# Altium schematic sheet main.SchDoc
size A4
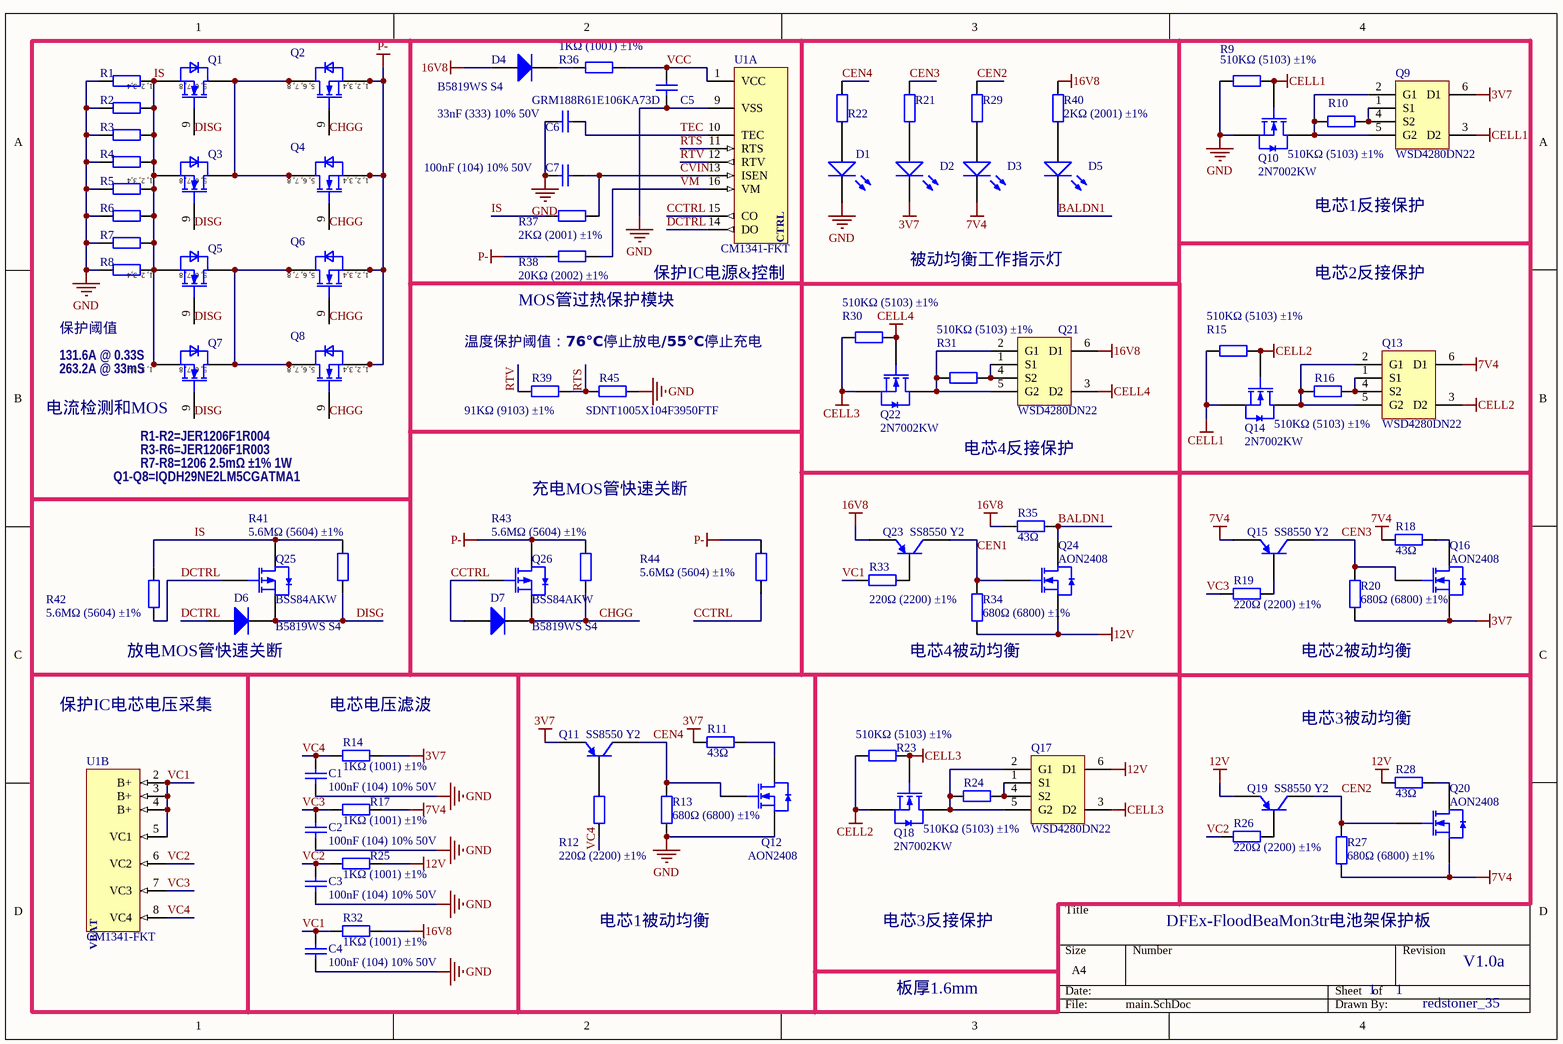
[diagram p0: main.SchDoc]

## Parts
C1  100nF (104) 10% 50V  [0402_C]
C2  100nF (104) 10% 50V  [0402_C]
C3  100nF (104) 10% 50V  [0402_C]
C4  100nF (104) 10% 50V  [0402_C]
C5  GRM188R61E106KA73D  [0603_C]
C6  33nF (333) 10% 50V  [0402_C]
C7  100nF (104) 10% 50V  [0402_C]
D1  白灯 0603  [0603_LED_S1]  (value not drawn)
D2  白灯 0603  [0603_LED_S1]  (value not drawn)
D3  白灯 0603  [0603_LED_S1]  (value not drawn)
D4  B5819WS S4  [SOD-323]
D5  白灯 0603  [0603_LED_S1]  (value not drawn)
D6  B5819WS S4  [SOD-323]
D7  B5819WS S4  [SOD-323]
Q1  IQDH29NE2LM5CG  [IFX-PG-WHTFN-9-2-V]  (value not drawn)
Q2  IQDH29NE2LM5CG  [IFX-PG-WHTFN-9-2-V]  (value not drawn)
Q3  IQDH29NE2LM5CG  [IFX-PG-WHTFN-9-2-V]  (value not drawn)
Q4  IQDH29NE2LM5CG  [IFX-PG-WHTFN-9-2-V]  (value not drawn)
Q5  IQDH29NE2LM5CG  [IFX-PG-WHTFN-9-2-V]  (value not drawn)
Q6  IQDH29NE2LM5CG  [IFX-PG-WHTFN-9-2-V]  (value not drawn)
Q7  IQDH29NE2LM5CG  [IFX-PG-WHTFN-9-2-V]  (value not drawn)
Q8  IQDH29NE2LM5CG  [IFX-PG-WHTFN-9-2-V]  (value not drawn)
Q9  WSD4280DN22  [UDFN-6_L2.0-W2.0-P0.65-BL_NTLUD3A50PZ]
Q10  2N7002KW  [SC70-3]
Q11  SS8550 Y2  [SC70-3]
Q12  AON2408  [PDFN-6_L2.0-W2.0-P0.65-BL-EP]
Q13  WSD4280DN22  [UDFN-6_L2.0-W2.0-P0.65-BL_NTLUD3A50PZ]
Q14  2N7002KW  [SC70-3]
Q15  SS8550 Y2  [SC70-3]
Q16  AON2408  [PDFN-6_L2.0-W2.0-P0.65-BL-EP]
Q17  WSD4280DN22  [UDFN-6_L2.0-W2.0-P0.65-BL_NTLUD3A50PZ]
Q18  2N7002KW  [SC70-3]
Q19  SS8550 Y2  [SC70-3]
Q20  AON2408  [PDFN-6_L2.0-W2.0-P0.65-BL-EP]
Q21  WSD4280DN22  [UDFN-6_L2.0-W2.0-P0.65-BL_NTLUD3A50PZ]
Q22  2N7002KW  [SC70-3]
Q23  SS8550 Y2  [SC70-3]
Q24  AON2408  [PDFN-6_L2.0-W2.0-P0.65-BL-EP]
Q25  BSS84AKW  [SC70-3]
Q26  BSS84AKW  [SC70-3]
R1  JER1206F1R004  [1206R]  (value not drawn)
R2  JER1206F1R004  [1206R]  (value not drawn)
R3  JER1206F1R003  [1206R]  (value not drawn)
R4  JER1206F1R003  [1206R]  (value not drawn)
R5  JER1206F1R003  [1206R]  (value not drawn)
R6  JER1206F1R003  [1206R]  (value not drawn)
R7  1206 2.5mΩ ±1% 1W  [1206R]  (value not drawn)
R8  1206 2.5mΩ ±1% 1W  [1206R]  (value not drawn)
R9  510KΩ (5103) ±1%  [0402_R]
R10  510KΩ (5103) ±1%  [0402_R]
R11  43Ω  [1210R]
R12  220Ω (2200) ±1%  [0402_R]
R13  680Ω (6800) ±1%  [0402_R]
R14  1KΩ (1001) ±1%  [0402_R]
R15  510KΩ (5103) ±1%  [0402_R]
R16  510KΩ (5103) ±1%  [0402_R]
R17  1KΩ (1001) ±1%  [0402_R]
R18  43Ω  [1210R]
R19  220Ω (2200) ±1%  [0402_R]
R20  680Ω (6800) ±1%  [0402_R]
R21  2KΩ (2001) ±1%  [0402_R]  (value not drawn)
R22  2KΩ (2001) ±1%  [0402_R]  (value not drawn)
R23  510KΩ (5103) ±1%  [0402_R]
R24  510KΩ (5103) ±1%  [0402_R]
R25  1KΩ (1001) ±1%  [0402_R]
R26  220Ω (2200) ±1%  [0402_R]
R27  680Ω (6800) ±1%  [0402_R]
R28  43Ω  [1210R]
R29  2KΩ (2001) ±1%  [0402_R]  (value not drawn)
R30  510KΩ (5103) ±1%  [0402_R]
R31  510KΩ (5103) ±1%  [0402_R]
R32  1KΩ (1001) ±1%  [0402_R]
R33  220Ω (2200) ±1%  [0402_R]
R34  680Ω (6800) ±1%  [0402_R]
R35  43Ω  [1210R]
R36  1KΩ (1001) ±1%  [0402_R]
R37  2KΩ (2001) ±1%  [0402_R]
R38  20KΩ (2002) ±1%  [0402_R]
R39  91KΩ (9103) ±1%  [0402_R]
R40  2KΩ (2001) ±1%  [0402_R]
R41  5.6MΩ (5604) ±1%  [0402_R]
R42  5.6MΩ (5604) ±1%  [0402_R]
R43  5.6MΩ (5604) ±1%  [0402_R]
R44  5.6MΩ (5604) ±1%  [0402_R]
R45  SDNT1005X104F3950FTF  [0402_R]
U1  CM1341-FKT  [TSSOP16-CM1341]  (parts A,B of 2)

## Nets
3V7: D2.K Q9.6(D1) Q11.2(E) Q16.2(S) R11.2 R14.2 R20.1
7V4: D3.K Q13.6(D1) Q15.2(E) Q20.2(S) R17.2 R18.2 R27.1
12V: Q17.6(D1) Q19.2(E) Q24.2(S) R25.2 R28.2 R34.1
16V8: D4.1(A) Q21.6(D1) Q23.2(E) R32.2 R35.2 R40.2
CELL1: Q9.3(D2) Q10.1(G) Q14.2(S) R9.1 R15.1
CELL2: Q13.3(D2) Q14.1(G) Q18.2(S) R15.2 R23.1
CELL3: Q17.3(D2) Q18.1(G) Q22.2(S) R23.2 R30.1
CELL4: Q21.3(D2) Q22.1(G) R30.2
GND: C1.1 C2.1 C3.1 C4.1 C5.1 C6.1 C7.1 D1.K Q10.2(S) Q12.2(S) R1.2 R2.2 R3.2 R4.2 R5.2 R6.2 R7.2 R8.2 R9.2 R13.1 R45.1 U1.9(VSS)
P-: Q2.1(SOURCE1) Q2.2(SOURCE2) Q2.3(SOURCE3) Q2.4(SOURCE4) Q4.1(SOURCE1) Q4.2(SOURCE2) Q4.3(SOURCE3) Q4.4(SOURCE4) Q6.1(SOURCE1) Q6.2(SOURCE2) Q6.3(SOURCE3) Q6.4(SOURCE4) Q8.1(SOURCE1) Q8.2(SOURCE2) Q8.3(SOURCE3) Q8.4(SOURCE4) Q26.3(D) R38.1 R43.2 R44.2
BALDN1: D5.K Q24.3(D) R35.1
CCTRL: D7.1(A) Q26.1(G) R44.1 U1.15(CO)
CEN1: Q23.3(C) Q24.1(G) R34.2
CEN2: Q19.3(C) Q20.1(G) R27.2 R29.2
CEN3: Q15.3(C) Q16.1(G) R20.2 R21.2
CEN4: Q11.3(C) Q12.1(G) R13.2 R22.2
CHGG: D7.2(K) Q2.9(GATE) Q4.9(GATE) Q6.9(GATE) Q8.9(GATE) Q26.2(S) R43.1
CVIN: C7.2 R37.2 U1.13(ISEN)
DCTRL: D6.1(A) Q25.1(G) R42.1 U1.14(DO)
DISG: D6.2(K) Q1.9(GATE) Q3.9(GATE) Q5.9(GATE) Q7.9(GATE) Q25.2(S) R41.1
IS: Q1.1(SOURCE1) Q1.2(SOURCE2) Q1.3(SOURCE3) Q1.4(SOURCE4) Q3.1(SOURCE1) Q3.2(SOURCE2) Q3.3(SOURCE3) Q3.4(SOURCE4) Q5.1(SOURCE1) Q5.2(SOURCE2) Q5.3(SOURCE3) Q5.4(SOURCE4) Q7.1(SOURCE1) Q7.2(SOURCE2) Q7.3(SOURCE3) Q7.4(SOURCE4) Q25.3(D) R1.1 R2.1 R3.1 R4.1 R5.1 R6.1 R7.1 R8.1 R37.1 R41.2 R42.2
RTS: R39.1 R45.2 U1.11(RTS)
RTV: R39.2 U1.12(RTV)
TEC: C6.2 U1.10(TEC)
VC1: C4.2 R32.1 R33.1 U1.2(B+) U1.3(B+) U1.4(B+) U1.5(VC1)
VC2: C3.2 R25.1 R26.1 U1.6(VC2)
VC3: C2.2 R17.1 R19.1 U1.7(VC3)
VC4: C1.2 R12.1 R14.1 U1.8(VC4)
VCC: C5.2 R36.2 U1.1(VCC)
VM: R38.2 U1.16(VM)
NetD1_A: D1.A R22.1
NetD2_A: D2.A R21.1
NetD3_A: D3.A R29.1
NetD4_2: D4.2(K) R36.1
NetD5_A: D5.A R40.1
NetQ1_5: Q1.5(DRAIN1) Q1.6(DRAIN2) Q1.7(DRAIN3) Q1.8(DRAIN4) Q2.5(DRAIN1) Q2.6(DRAIN2) Q2.7(DRAIN3) Q2.8(DRAIN4) Q3.5(DRAIN1) Q3.6(DRAIN2) Q3.7(DRAIN3) Q3.8(DRAIN4) Q4.5(DRAIN1) Q4.6(DRAIN2) Q4.7(DRAIN3) Q4.8(DRAIN4)
NetQ5_5: Q5.5(DRAIN1) Q5.6(DRAIN2) Q5.7(DRAIN3) Q5.8(DRAIN4) Q6.5(DRAIN1) Q6.6(DRAIN2) Q6.7(DRAIN3) Q6.8(DRAIN4) Q7.5(DRAIN1) Q7.6(DRAIN2) Q7.7(DRAIN3) Q7.8(DRAIN4) Q8.5(DRAIN1) Q8.6(DRAIN2) Q8.7(DRAIN3) Q8.8(DRAIN4)
NetQ9_1: Q9.1(S1) Q9.4(S2) R10.1
NetQ9_2: Q9.2(G1) Q9.5(G2) Q10.3(D) R10.2
NetQ11_1: Q11.1(B) R12.2
NetQ12_3: Q12.3(D) R11.1
NetQ13_1: Q13.1(S1) Q13.4(S2) R16.2
NetQ13_2: Q13.2(G1) Q13.5(G2) Q14.3(D) R16.1
NetQ15_1: Q15.1(B) R19.2
NetQ16_3: Q16.3(D) R18.1
NetQ17_1: Q17.1(S1) Q17.4(S2) R24.2
NetQ17_2: Q17.2(G1) Q17.5(G2) Q18.3(D) R24.1
NetQ19_1: Q19.1(B) R26.2
NetQ20_3: Q20.3(D) R28.1
NetQ21_1: Q21.1(S1) Q21.4(S2) R31.2
NetQ21_2: Q21.2(G1) Q21.5(G2) Q22.3(D) R31.1
NetQ23_1: Q23.1(B) R33.2

## Notes on the sheet
- 电芯1反接保护
- (near R38) MOS管过热保护模块
- (near U1) 保护IC电源&控制
- 被动均衡工作指示灯
- 电芯2反接保护
- 保护阈值
- (near Q7) 131.6A @ 0.33S
- (near Q7) 263.2A @ 33mS
- 温度保护阈值：76℃停止放电/55℃停止充电
- 电流检测和MOS
- R1-R2=JER1206F1R004
- R3-R6=JER1206F1R003
- 电芯4反接保护
- Q1-Q8=IQDH29NE2LM5CGATMA1
- R7-R8=1206 2.5mΩ ±1% 1W
- 充电MOS管快速关断
- 放电MOS管快速关断
- (near R34) 电芯4被动均衡
- (near R20) 电芯2被动均衡
- 保护IC电芯电压采集
- 电芯电压滤波
- 电芯3被动均衡
- 电芯1被动均衡
- 电芯3反接保护
- DFEx-FloodBeaMon3tr电池架保护板
- 板厚1.6mm
- 1
- V1.0a
- redstoner_35
- (in symbol CM1341-FKT, part A) CTRL
- (in symbol CM1341-FKT, part B) VBAT
- (in symbol IQDH29NE2LM5CGSC) 5, 6, 7, 8; 1, 2, 3,4

## Library data of the parts
C1-C4 = 0402 220nF (224) 10% 16V: 贴片电容; ComponentLink1Description: 供应商链接; ComponentLink1URL: http://www.szlcsc.com/product/details_17456.html; Package: 0402; Supplier: LC; SuppliersPartNumber: C16772
C5 = 0603 10uF (106) 10% 10V: 0603贴片MLCC电容 10uF ±20% 25V X5R; ComponentLink1Description: 供应商链接; ComponentLink1URL: http://www.szlcsc.com/product/details_20411.html; Package: 0603; Supplier: LC; SuppliersPartNumber: C19702
C6 C7 = 0402 100nF (104) 10% 16V: 贴片电容; ComponentLink1Description: 供应商链接; ComponentLink1URL: http://www.szlcsc.com/product/details_1877.html; Package: 0402; Supplier: LC; SuppliersPartNumber: C1525
D1-D3 D5 = 0603 白灯: 发光二极管; ComponentLink1Description: 供应商链接; ComponentLink1URL: http://www.szlcsc.com/product/details_2663.html; Package: 0603; Supplier: LC; SuppliersPartNumber: C2290
D4 D6 D7 = SOD-323 1N4148WS T4: 二极管; ComponentLink1Description: 供应商链接; ComponentLink1URL: http://www.szlcsc.com/product/details_2485.html; Package: SOD-323; Supplier: LC; SuppliersPartNumber: C2128
Q1-Q8 = IQDH29NE2LM5CGSC: 英飞凌MOSFET 25V 789A 0.2mΩ @ 10V WHTFN-9(PDFN5x6源极底置)封装; Manufacturer: Infineon Technologies; PackageReference: PG-WHTFN-9-2; Manufacturer Order Number: IQDH29NE2LM5CGSC
Q9 Q13 Q17 Q21 = NTLUD3A50PZ: 内置肖特基二极管的双P沟道MOS -15V -4.6A 45mΩ @ 4.5V DFN2x2封装
Q10 Q14 Q18 Q22 = 2N7002 7002: 单N沟道MOSFET(场效应管); ComponentLink1Description: 供应商链接; ComponentLink1URL: http://www.szlcsc.com/product/details_9040.html; Package: SOT-323; Supplier: LC; SuppliersPartNumber: C???????
Q11 Q15 Q19 Q23 = SOT-23 SS8550 Y2: PNP三极管，SOT-323 封装; ComponentLink1Description: 供应商链接; ComponentLink1URL: http://www.szlcsc.com/product/details_9037.html; Package: SOT-23; Supplier: LC; SuppliersPartNumber: C8542
Q12 Q16 Q20 Q24 = AO3400A N道沟 X0YV1T SOT-23: MOS(场效应管); pin to pad: 1>G 2>S 3>D; ComponentLink1Description: 供应商链接; ComponentLink1URL: http://www.szlcsc.com/product/details_21629.html; Package: SOT-23; Supplier: LC; SuppliersPartNumber: C20917
Q25 Q26 = SI2301CDS-T1-GE3: 单P沟道小信号MOSFET(场效应管); ComponentLink1Description: 供应商链接; ComponentLink1URL: http://www.szlcsc.com/product/details_11030.html; Package: SOT-23(SOT-23-3); Supplier: LC; SuppliersPartNumber: C10487
R1 R2 = Res: 贴片合金电流检测电阻 1206封装 4mΩ ±1% 1W; Published: 8-Jun-2000; LatestRevisionDate: 17-Jul-2002; LatestRevisionNote: Re-released for DXP Platform.; PackageReference: AXIAL-0.4; Publisher: Altium Limited; PackageDescription: Axial Device, Thru-Hole; 2 Leads; 0.4 in Pin Spacing; Value: 4mΩ
R3-R6 = Res: 贴片合金电流检测电阻 1206封装 3mΩ ±1% 1W; Published: 8-Jun-2000; LatestRevisionDate: 17-Jul-2002; LatestRevisionNote: Re-released for DXP Platform.; PackageReference: AXIAL-0.4; Publisher: Altium Limited; PackageDescription: Axial Device, Thru-Hole; 2 Leads; 0.4 in Pin Spacing; Value: 3mΩ
R7 R8 = Res: 贴片合金检流电阻 1206 2.5mΩ ±1% 1W; Published: 8-Jun-2000; LatestRevisionDate: 17-Jul-2002; LatestRevisionNote: Re-released for DXP Platform.; PackageReference: AXIAL-0.4; Publisher: Altium Limited; PackageDescription: Axial Device, Thru-Hole; 2 Leads; 0.4 in Pin Spacing; Value: 2.5mΩ
R9 R10 R15 R16 R23 R24 R30 R31 = 0402 510KΩ (5103) 1%: 贴片电阻; ComponentLink1Description: 供应商链接; ComponentLink1URL: http://www.szlcsc.com/product/details_12170.html; Package: 0402; Supplier: LC; SuppliersPartNumber: C11616
R11 R18 R28 R35 = Res: Resistor; Published: 8-Jun-2000; LatestRevisionDate: 17-Jul-2002; LatestRevisionNote: Re-released for DXP Platform.; PackageReference: AXIAL-0.4; Publisher: Altium Limited; PackageDescription: Axial Device, Thru-Hole; 2 Leads; 0.4 in Pin Spacing; Value: 43Ω
R12 R19 R26 R33 = 0402 220Ω (2200) 1%: 贴片电阻; ComponentLink1Description: 供应商链接; ComponentLink1URL: http://www.szlcsc.com/product/details_25834.html; Package: 0402; Supplier: LC; SuppliersPartNumber: C25091
R13 R20-R22 R27 R29 R34 R37 R40 = 0402 2KΩ (2001) 1%: 贴片电阻; ComponentLink1Description: 供应商链接; ComponentLink1URL: http://www.szlcsc.com/product/details_4516.html; Package: 0402; Supplier: LC; SuppliersPartNumber: C4109
R14 R17 R25 R32 R36 = 0402 1KΩ (1001) 1%: 贴片电阻; ComponentLink1Description: 供应商链接; ComponentLink1URL: http://www.szlcsc.com/product/details_12256.html; Package: 0402; Supplier: LC; SuppliersPartNumber: C11702
R38 = 0402 20KΩ (2002) 1%: 贴片电阻; ComponentLink1Description: 供应商链接; ComponentLink1URL: http://www.szlcsc.com/product/details_26508.html; Package: 0402; Supplier: LC; SuppliersPartNumber: C25765
R39 = 0402 100KΩ (1003) 1%: 贴片电阻; ComponentLink1Description: 供应商链接; ComponentLink1URL: http://www.szlcsc.com/product/details_26484.html; Package: 0402; Supplier: LC; SuppliersPartNumber: C25741
R41-R44 = 0402 1MΩ (1004) 1%: 贴片电阻; ComponentLink1Description: 供应商链接; ComponentLink1URL: http://www.szlcsc.com/product/details_26826.html; Package: 0402; Supplier: LC; SuppliersPartNumber: C26083
R45 = 0402 100KΩ (1003) 1%: 100KΩ (1003) ±1% B3950 NTC片式贴片热敏电阻; ComponentLink1Description: 供应商链接; ComponentLink1URL: http://www.szlcsc.com/product/details_26484.html; Package: 0402; Supplier: LC; SuppliersPartNumber: C25741
U1 = CM1341-FKT: 4串三元锂电池带均衡功能保护IC，SSOP16封装。